# EAGLE design SNES-logo-leds (EAGLE 7.3.0)
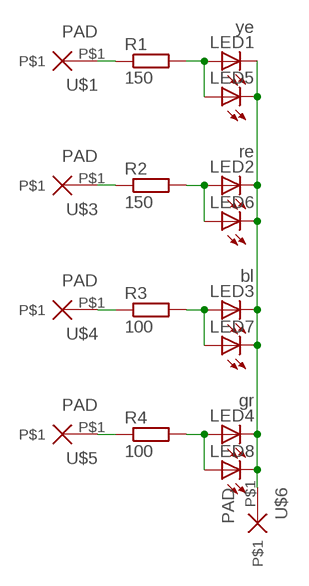
[diagram p0: schematic, sheet 1]

## Parts
LED1  ye  LEDSML0805  [SML0805]
LED2  re  LEDSML0805  [SML0805]
LED3  bl  LEDSML0805  [SML0805]
LED4  gr  LEDSML0805  [SML0805]
LED5  LEDP-LCC-2  [P-LCC-2]
LED6  LEDP-LCC-2  [P-LCC-2]
LED7  LEDP-LCC-2  [P-LCC-2]
LED8  LEDP-LCC-2  [P-LCC-2]
R1  150  R0805  [Z0805]
R2  150  R0805  [Z0805]
R3  100  R0805  [Z0805]
R4  100  R0805  [Z0805]
U$1  PAD  [PAD]
U$3  PAD  [PAD]
U$4  PAD  [PAD]
U$5  PAD  [PAD]
U$6  PAD  [PAD]

## Nets
N$1: LED1.C LED2.C LED3.C LED4.C LED5.C LED6.C LED7.C LED8.C U$6.P$1
N$2: R2.1 U$3.P$1
N$3: LED1.A LED5.A R1.2
N$4: R1.1 U$1.P$1
N$5: R3.1 U$4.P$1
N$6: R4.1 U$5.P$1
N$20: LED2.A LED6.A R2.2
N$21: LED3.A LED7.A R3.2
N$22: LED4.A LED8.A R4.2

## Library data of the parts
LED1-LED8 = led:LED: LED OSRAM: - CHIPLED LG R971, LG N971, LY N971, LG Q971, LY Q971, LO R971, LY R971 LH N974, LH R974 LS Q976, LO Q976, LY Q976 LO Q996 - Hyper CHIPLED LW Q18S LB Q993, LB Q99A, LB R99A - SideLED LS A670, LO A670, LY A670, LG A670, LP A670 LB A673, LV A673, LT A673, LW A673 LH A674 LY A675 LS A676, LA A676, LO A676, LY A676, LW A676 LS A679, LY A679, LG A679 - Hyper Micro SIDELED® LS Y876, LA Y876, LO Y876, LY Y876 LT Y87S - SmartLED LW L88C, LW L88S LB L89C, LB L89S, LG L890 LS L89K, LO L89K, LY L89K LS L896, LA L896, LO L896, LY L896 - TOPLED LS T670, LO T670, LY T670, LG T670, LP T670 LSG T670, LSP T670, LSY T670, LOP T670, LYG T670 LG T671, LOG T671, LSG T671 LB T673, LV T673, LT T673, LW T673 LH T674 LS T676, LA T676, LO T676, LY T676, LB T676, LH T676, LSB T676, LW T676 LB T67C, LV T67C, LT T67C, LS T67K, LO T67K, LY T67K, LW E67C LS E67B, LA E67B, LO E67B, LY E67B, LB E67C, LV E67C, LT E67C LW T67C LS T679, LY T679, LG T679 LS T770, LO T770, LY T770, LG T770, LP T770 LB T773, LV T773, LT T773, LW T773 LH T774 LS E675, LA E675, LY E675, LS T675 LS T776, LA T776, LO T776, LY T776, LB T776 LHGB T686 LT T68C, LB T68C - Hyper Mini TOPLED® LB M676 - Mini TOPLED Santana® LG M470 LS M47K, LO M47K, LY M47K Source: http://www.osram.convergy.de LUXEON: - LUMILED® LXK2-PW12-R00, LXK2-PW12-S00, LXK2-PW14-U00, LXK2-PW14-V00 LXK2-PM12-R00, LXK2-PM12-S00, LXK2-PM14-U00 LXK2-PE12-Q00, LXK2-PE12-R00, LXK2-PE12-S00, LXK2-PE14-T00, LXK2-PE14-U00 LXK2-PB12-K00, LXK2-PB12-L00, LXK2-PB12-M00, LXK2-PB14-N00, LXK2-PB14-P00, LXK2-PB14-Q00 LXK2-PR12-L00, LXK2-PR12-M00, LXK2-PR14-Q00, LXK2-PR14-R00 LXK2-PD12-Q00, LXK2-PD12-R00, LXK2-PD12-S00 LXK2-PH12-R00, LXK2-PH12-S00 LXK2-PL12-P00, LXK2-PL12-Q00, LXK2-PL12-R00 Source: www.luxeon.com KINGBRIGHT: KA-3528ASYC Source: www.kingbright.com
R1-R4 = snes_div:R0805
U$1 U$3-U$6 = MS_Mod:PAD

## Board
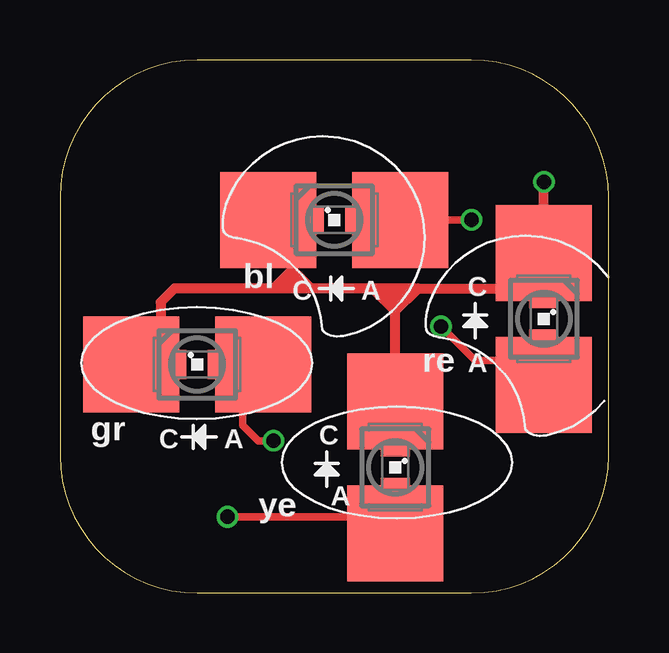
[diagram p1: board, top side]
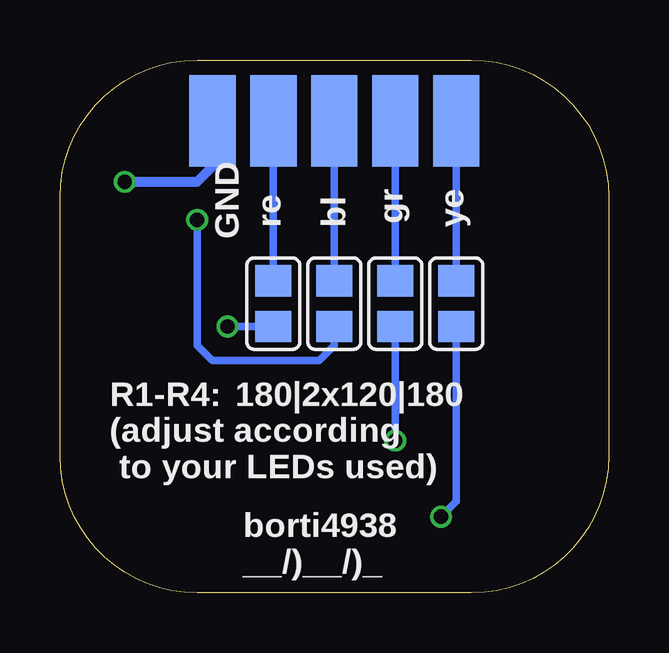
[diagram p2: board, bottom side, seen from below]

Size 22.86 x 22.22 mm. Coordinates in mm from the lower left corner, seen from the top.
Outline: 0,16.51 0,5.71 arc90 5.71,0 17.14,0 arc90 22.86,5.71 22.86,16.51 arc90 17.14,22.22 5.71,22.22 arc90 0,16.51
Copper layers (1*16): Top 0.035mm / dielectric 1.5mm / Bottom 0.035mm
Design rules "ITEADstudio_DRC": minimum track width 6mil, minimum drill 12mil, track to track 6mil, track to pad 6mil, pad to pad 6mil, via to via 6mil, smd to smd 0mil, copper to edge 10mil, drill to drill 10mil, minimum pad ring 10mil, minimum via ring 6mil, stop-mask expansion 2mil, vias tented up to drill 30mil, thermal gap 10mil

### Footprints (pad centres in the part's own frame; a part is rotated, then mirrored left to right if it is on the bottom)
SML0805 = smd 1.2 x 1.2: A 1.05,0; C -1.05,0
P-LCC-2 = smd 4 x 4: A 0,2.75; C 0,-2.75
Z0805 = smd 1.3 x 1.5: 1 -0.95,0; 2 0.95,0
PAD = smd 1.93 x 3.81: P$1 0,0

### Placement (x,y rotation side)
LED1  13.97,5.24 270 top
LED2  20.16,11.43 270 top
LED3  11.43,15.56 0 top
LED4  5.71,9.53 0 top
LED5  13.97,5.24 180 top
LED6  20.16,11.43 180 top
LED7  11.43,15.56 270 top
LED8  5.71,9.53 270 top
R1  6.35,12.06 270 bottom
R2  13.97,12.06 270 bottom
R3  11.43,12.06 270 bottom
R4  8.89,12.06 270 bottom
U$1  6.35,19.68 0 bottom
U$3  13.97,19.68 0 bottom
U$4  11.43,19.68 0 bottom
U$5  8.89,19.68 0 bottom
U$6  16.51,19.68 0 bottom

### Tracks (layer width: path | path; a pad name or v marks a point on that pad's centre or on a via)
N$1  (via drill 0.6)
  Top 0.406: LED8.C 3.81,9.53 | 3.81,9.53 LED4.C | 14.76,12.7 14.92,12.7 | 14.92,12.7 19.94,12.7 | 19.94,12.7 LED2.C | 19.94,12.7 19.94,13.96 LED6.C v20.16,17.14 | LED3.C LED7.C 8.68,15.13 9.68,14.13 9.68,13.49 | 9.68,13.49 10.48,12.7 | 10.48,12.7 9.37,12.7 | 9.37,12.7 8.89,12.7 | 8.89,12.7 9.68,13.49 | 9.68,13.49 9.68,13.18 10,12.86 9.53,12.86 9.37,12.7 | 8.89,12.7 4.76,12.7 4.19,12.13 4.19,9.9 3.81,9.53 | LED1.C LED5.C 13.97,11.75 | 13.97,11.91 14.76,12.7 | 14.45,12.7 13.49,12.7 | 13.49,12.7 13.18,12.7 | 13.97,11.75 14.92,12.7 | 14.76,12.7 14.45,12.7 | 14.45,12.7 13.97,12.22 13.49,12.7 | 13.02,12.7 10.48,12.7 | 13.97,11.75 13.97,11.91 | 13.97,11.91 13.18,12.7 | 13.18,12.7 13.02,12.7 | 13.02,12.7 13.97,11.75
  Bottom 0.406: v20.16,17.14 17.14,17.14 16.51,17.78 U$6.P$1
N$2
  Bottom 0.305: U$3.P$1 R2.1
N$3  (via drill 0.6)
  Top 0.305: v6.99,3.17 13.34,3.17 13.97,2.54 LED1.A LED5.A
  Bottom 0.305: R1.2 6.35,3.81 v6.99,3.17
N$4
  Bottom 0.305: U$1.P$1 R1.1
N$5
  Bottom 0.305: U$4.P$1 R3.1
N$6
  Bottom 0.305: U$5.P$1 R4.1
N$20  (via drill 0.6)
  Top 0.305: v15.88,11.11 17.3,9.68 20.16,9.68 | LED6.A 20.16,9.68 | 20.16,9.68 LED2.A
  Bottom 0.305: R2.2 15.71,11.12 v15.88,11.11
N$21  (via drill 0.6)
  Top 0.305: v17.14,15.56 LED7.A LED3.A
  Bottom 0.305: R3.2 11.43,10.32 12.06,9.68 16.51,9.68 17.14,10.32 v17.14,15.56
N$22  (via drill 0.6)
  Top 0.305: v8.89,6.35 8.26,6.35 7.62,6.98 7.62,9.53 | 7.62,9.53 LED4.A | LED8.A 7.62,9.53
  Bottom 0.305: R4.2 v8.89,6.35

### Text on the board
tNames: bl | C | A | C | re | A | gr | C | A | C | ye | A
bNames: ye | gr | bl | re | GND | 180|2x120|180 | R1-R4: | (adjust according / to your LEDs used) | borti4938 / __/)__/)_